# EasyEDA Pro project ProPrj_遥控_2025-12-06.epro, schematic su-03t_1
Board Name: su-03t_1; Create Date: 2025-10-11; Page Name: P1; Project Name: 遥控; Schematic Name: su-03t_1; Update Date: 2025-10-11; Company: 嘉立创EDA; Page Size: A4; Version: V1.0
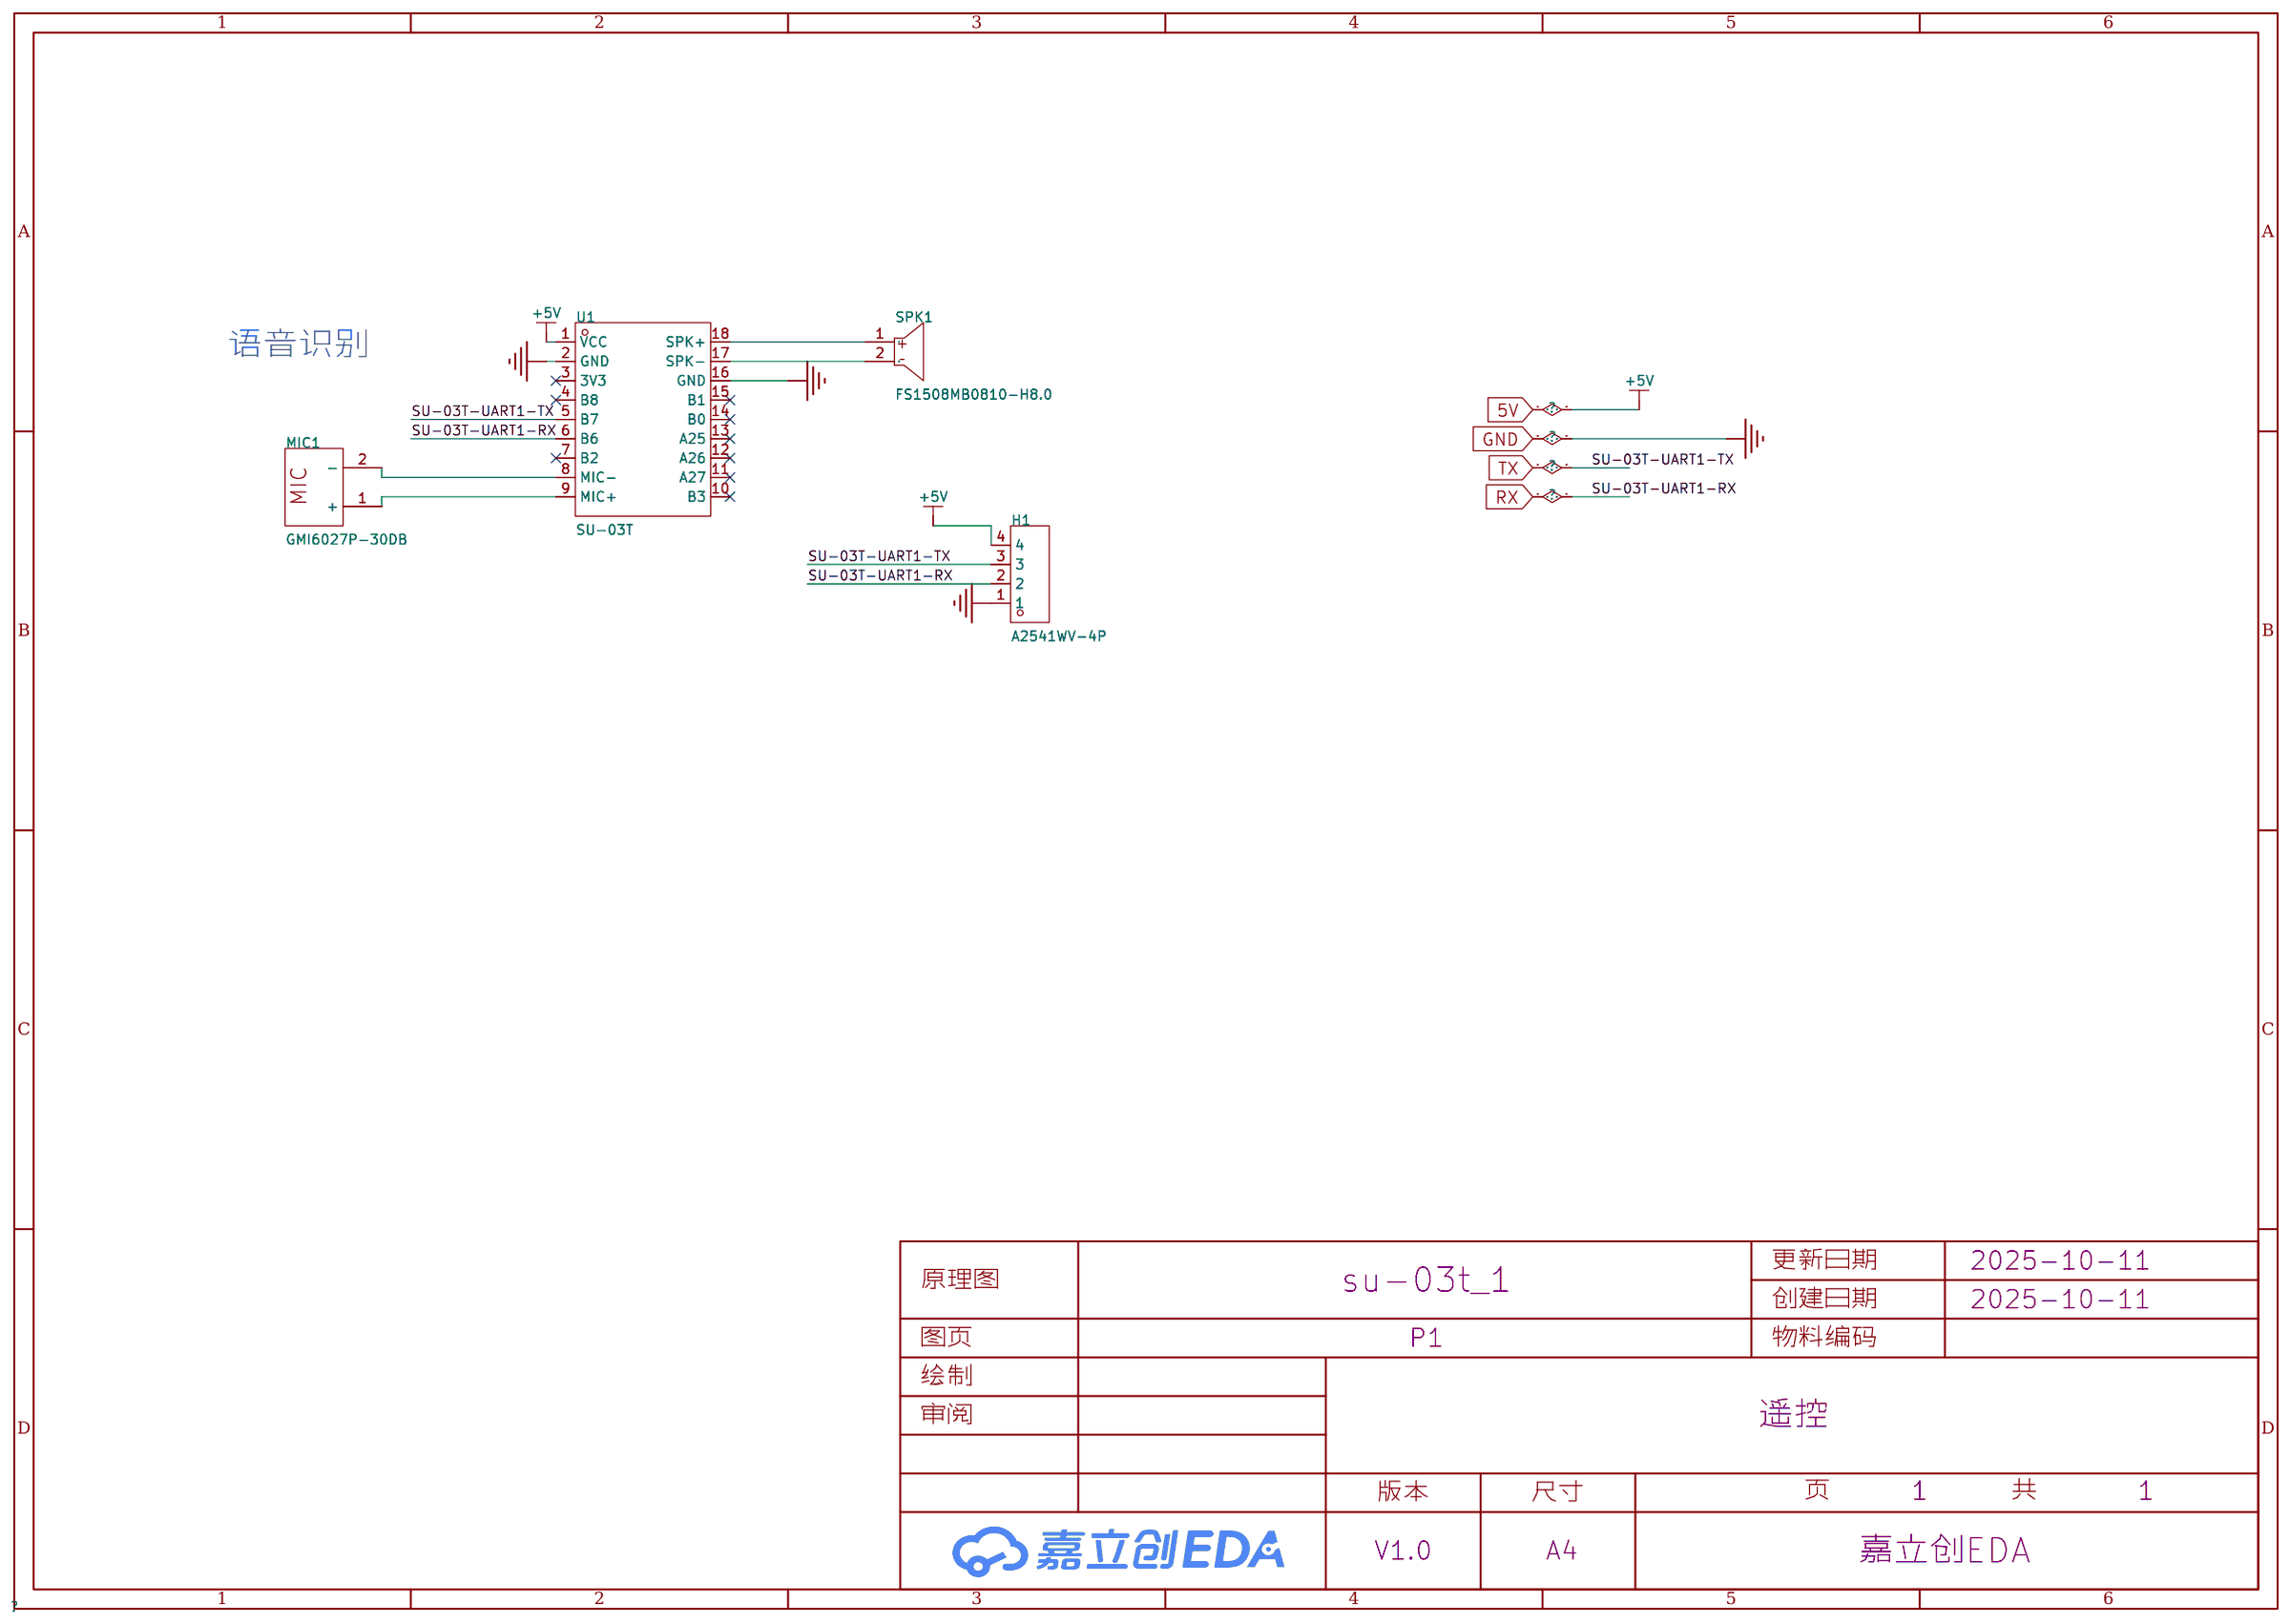
[diagram p5: schematic sheet]

## Parts
H1  A2541WV-4P  [HDR-TH_4P-P2.54-V-M]
MIC1  GMI6027P-30DB  [MIC-TH_BD6.0-P1.90-D0.4-L-FD]
SPK1  FS1508MB0810-H8.0  [BEEP-TH_BD15.0-P10.20-D1.2]
U1  SU-03T  [COMM-SMD_18P-L21.0-W15.0-P2.00]

## Library data of the parts
H1 = A2541WV-4P: 插针结构:1x4P;间距:2.54mm;行距:-;圆针/方针:方针;安装类型:直插;排数:单排;总PIN位数:4P;额定电流:3A;额定电压:250V;配合针长度:6mm;塑高:2.54mm;端接针长度:3mm;触头材质:黄铜;触头镀层:金;工作温度范围:-40℃~+105℃;颜色:黑色;; LCSC Part Name: 1x4P 间距:2.54mm 方针 直插; Supplier Part: C225479; Manufacturer: CJT(长江连接器); Supplier Footprint: 插件,P=2.54mm; Datasheet: https://atta.szlcsc.com/upload/public/pdf/source/20210317/C225479_66BE1F584C1491F50F59A7D7B65E2652.pdf; Supplier: LCSC; Pin Structure: 1x4P; Pitch: 2.54mm; Circluar Pins/Square Pins: 方针; Mounting Type: 直插; Number of Rows: 单排; Number of Pins: 4P; Current Rating (Max): 3A; Voltage Rating (Max): 250V; Length of Mating Pin: 6mm; Insulation Height: 2.54mm; Length of End Connection Pin: 3mm; Contact Material: 黄铜; Contact Plating: 金; Operating Temperature Range: -40℃~+105℃; Color: 黑色
MIC1 = GMI6027P-30DB: Supplier Part: C529952; Manufacturer: INGHAi(赢海); Datasheet: https://atta.szlcsc.com/upload/public/pdf/source/20200702/C529952_807F7012EAC801A742D0A79789145B73.pdf; Supplier: LCSC
SPK1 = FS1508MB0810-H8.0: 插针; LCSC Part Name: 喇叭; Supplier Part: C969972; Manufacturer: FUET(福声科技); Datasheet: https://atta.szlcsc.com/upload/public/pdf/source/20201214/C969972_AF680FD4EA01CCA3A240B6D561BC4FD9.pdf; Supplier: LCSC
U1 = SU-03T: 处理器:-;运行内存:-;USB:-;WIFI协议:-;蓝牙:-;以太网:-;; Supplier Part: C879203; Manufacturer: MACHINE INTELLIGENCE(机芯智能); JLCPCB Part Class: 扩展库; Datasheet: https://atta.szlcsc.com/upload/public/pdf/source/20201029/C879203_F32AEAE676882DD706CDA0C6D57F9671.pdf; Supplier: LCSC

## Nets
+5V: H1.4 U1.1(VCC)
GND: H1.1 U1.2(GND) U1.16(GND)
RX: H1.2 U1.6(B6)
SU-03T-UART1-TX: H1.3 U1.5(B7)
Net-(MIC1-1): MIC1.1(+) U1.9(MIC+)
Net-(MIC1-2): MIC1.2(-) U1.8(MIC-)
Net-(SPK1-1): SPK1.1 U1.18(SPK+)
Net-(SPK1-2): SPK1.2 U1.17(SPK-)

Not connected (* = marked no-connect by the designer): U1 3(3V3)* 4(B8)* 7(B2)* 10(B3)* 11(A27)* 12(A26)* 13(A25)* 14(B0)* 15(B1)*

## Notes on the sheet
- 语音识别
